# EAGLE design PIC PROTO-BOARD (EAGLE 9.2.2)

## Sheet 1 of 2
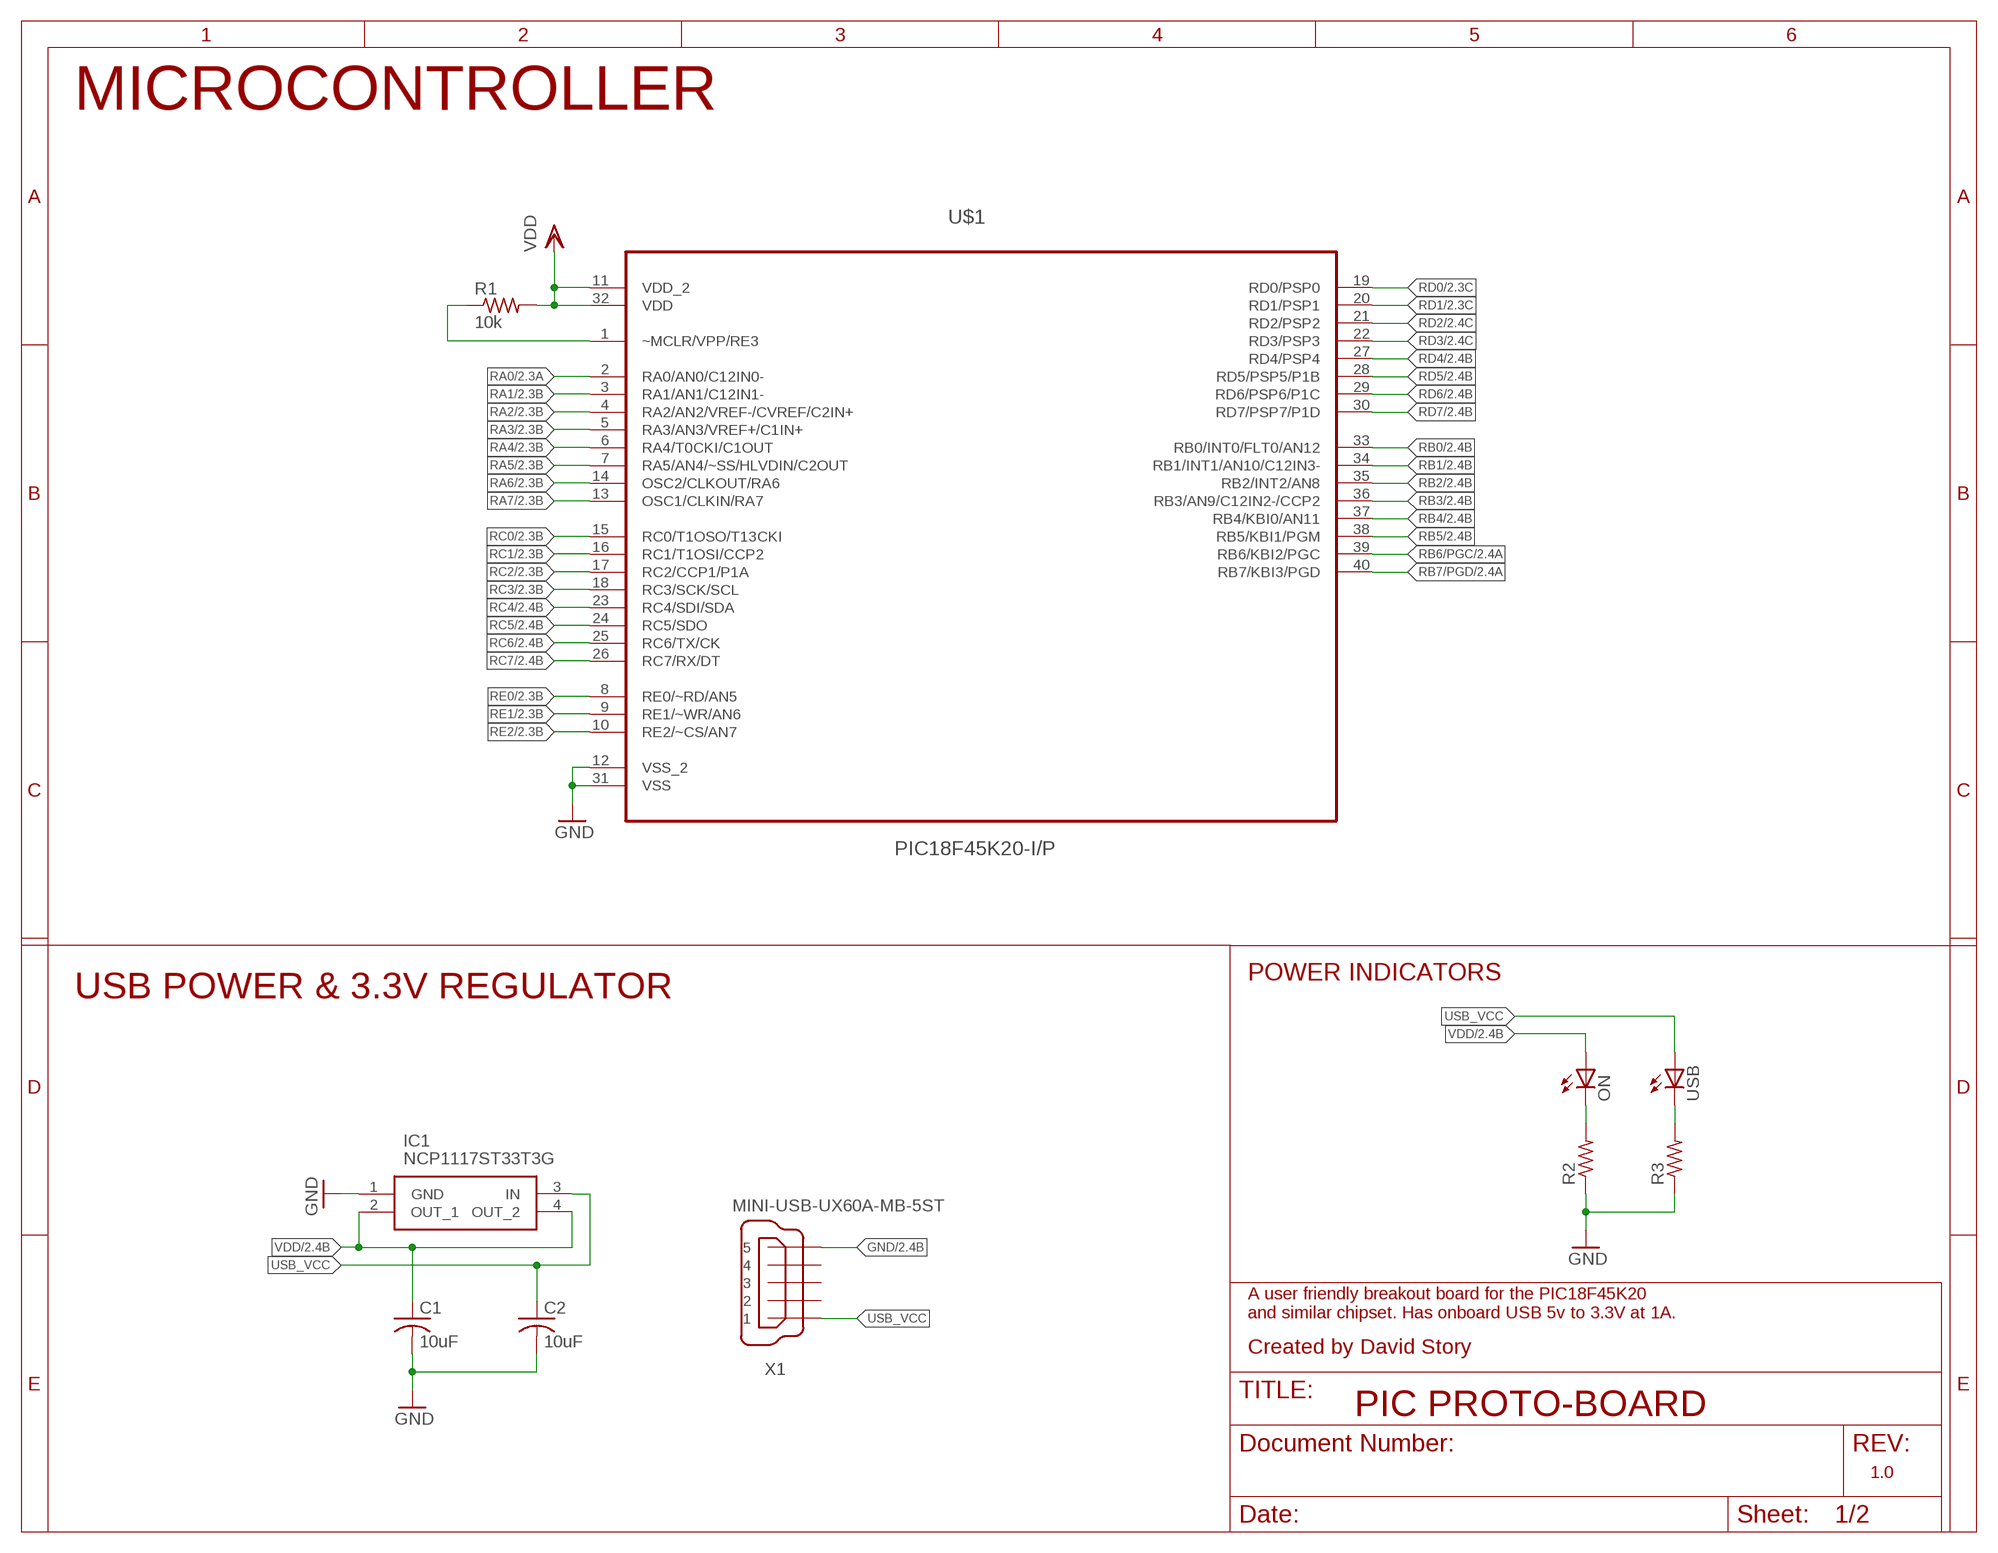
[diagram p0: schematic, sheet 1]

### Parts
C1  10uF  C-USC0805  [C0805]
C2  10uF  C-USC0805  [C0805]
IC1  NCP1117ST33T3G  [SOT230P700X180-4N]
ON  LEDCHIP-LED0603  [CHIP-LED0603]
R1  10k  R-US_R0805  [R0805]
R2  R-US_R0603  [R0603]
R3  R-US_R0603  [R0603]
U$1  PIC18F45K20-I/P  [DIP254P1524X635-40]
USB  LEDCHIP-LED0603  [CHIP-LED0603]
X1  MINI-USB-UX60A-MB-5ST  [UX60A-MB-5ST]

### Nets
GND: C1.2 C2.2 IC1.1(GND) R2.1 R3.1 U$1.12(VSS_2) U$1.31(VSS) X1.5 ; also sheet 2
MCLR: R1.1 U$1.1(~MCLR/VPP/RE3) ; also sheet 2
ON_CATHODE: ON.C R2.2
RA0: U$1.2(RA0/AN0/C12IN0-) ; also sheet 2
RA1: U$1.3(RA1/AN1/C12IN1-) ; also sheet 2
RA2: U$1.4(RA2/AN2/VREF-/CVREF/C2IN+) ; also sheet 2
RA3: U$1.5(RA3/AN3/VREF+/C1IN+) ; also sheet 2
RA4: U$1.6(RA4/T0CKI/C1OUT) ; also sheet 2
RA5: U$1.7(RA5/AN4/~SS/HLVDIN/C2OUT) ; also sheet 2
RA6: U$1.14(OSC2/CLKOUT/RA6) ; also sheet 2
RA7: U$1.13(OSC1/CLKIN/RA7) ; also sheet 2
RB0: U$1.33(RB0/INT0/FLT0/AN12) ; also sheet 2
RB1: U$1.34(RB1/INT1/AN10/C12IN3-) ; also sheet 2
RB2: U$1.35(RB2/INT2/AN8) ; also sheet 2
RB3: U$1.36(RB3/AN9/C12IN2-/CCP2) ; also sheet 2
RB4: U$1.37(RB4/KBI0/AN11) ; also sheet 2
RB5: U$1.38(RB5/KBI1/PGM) ; also sheet 2
RB6/PGC: U$1.39(RB6/KBI2/PGC) ; also sheet 2
RB7/PGD: U$1.40(RB7/KBI3/PGD) ; also sheet 2
RC0: U$1.15(RC0/T1OSO/T13CKI) ; also sheet 2
RC1: U$1.16(RC1/T1OSI/CCP2) ; also sheet 2
RC2: U$1.17(RC2/CCP1/P1A) ; also sheet 2
RC3: U$1.18(RC3/SCK/SCL) ; also sheet 2
RC4: U$1.23(RC4/SDI/SDA) ; also sheet 2
RC5: U$1.24(RC5/SDO) ; also sheet 2
RC6: U$1.25(RC6/TX/CK) ; also sheet 2
RC7: U$1.26(RC7/RX/DT) ; also sheet 2
RD0: U$1.19(RD0/PSP0) ; also sheet 2
RD1: U$1.20(RD1/PSP1) ; also sheet 2
RD2: U$1.21(RD2/PSP2) ; also sheet 2
RD3: U$1.22(RD3/PSP3) ; also sheet 2
RD4: U$1.27(RD4/PSP4) ; also sheet 2
RD5: U$1.28(RD5/PSP5/P1B) ; also sheet 2
RD6: U$1.29(RD6/PSP6/P1C) ; also sheet 2
RD7: U$1.30(RD7/PSP7/P1D) ; also sheet 2
RE0: U$1.8(RE0/~RD/AN5) ; also sheet 2
RE1: U$1.9(RE1/~WR/AN6) ; also sheet 2
RE2: U$1.10(RE2/~CS/AN7) ; also sheet 2
USB_CATHODE: R3.2 USB.C
USB_VCC: C2.1 IC1.3(IN) USB.A X1.1
VDD: C1.1 IC1.2(OUT_1) IC1.4(OUT_2) ON.A R1.2 U$1.11(VDD_2) U$1.32(VDD) ; also sheet 2
Unconnected: X1.2 X1.3 X1.4

### Notes on the sheet
- MICROCONTROLLER
- POWER INDICATORS
- USB POWER & 3.3V REGULATOR
- A user friendly breakout board for the PIC18F45K20
  and similar chipset. Has onboard USB 5v to 3.3V at 1A.
- Created by David Story
- 1.0

## Sheet 2 of 2
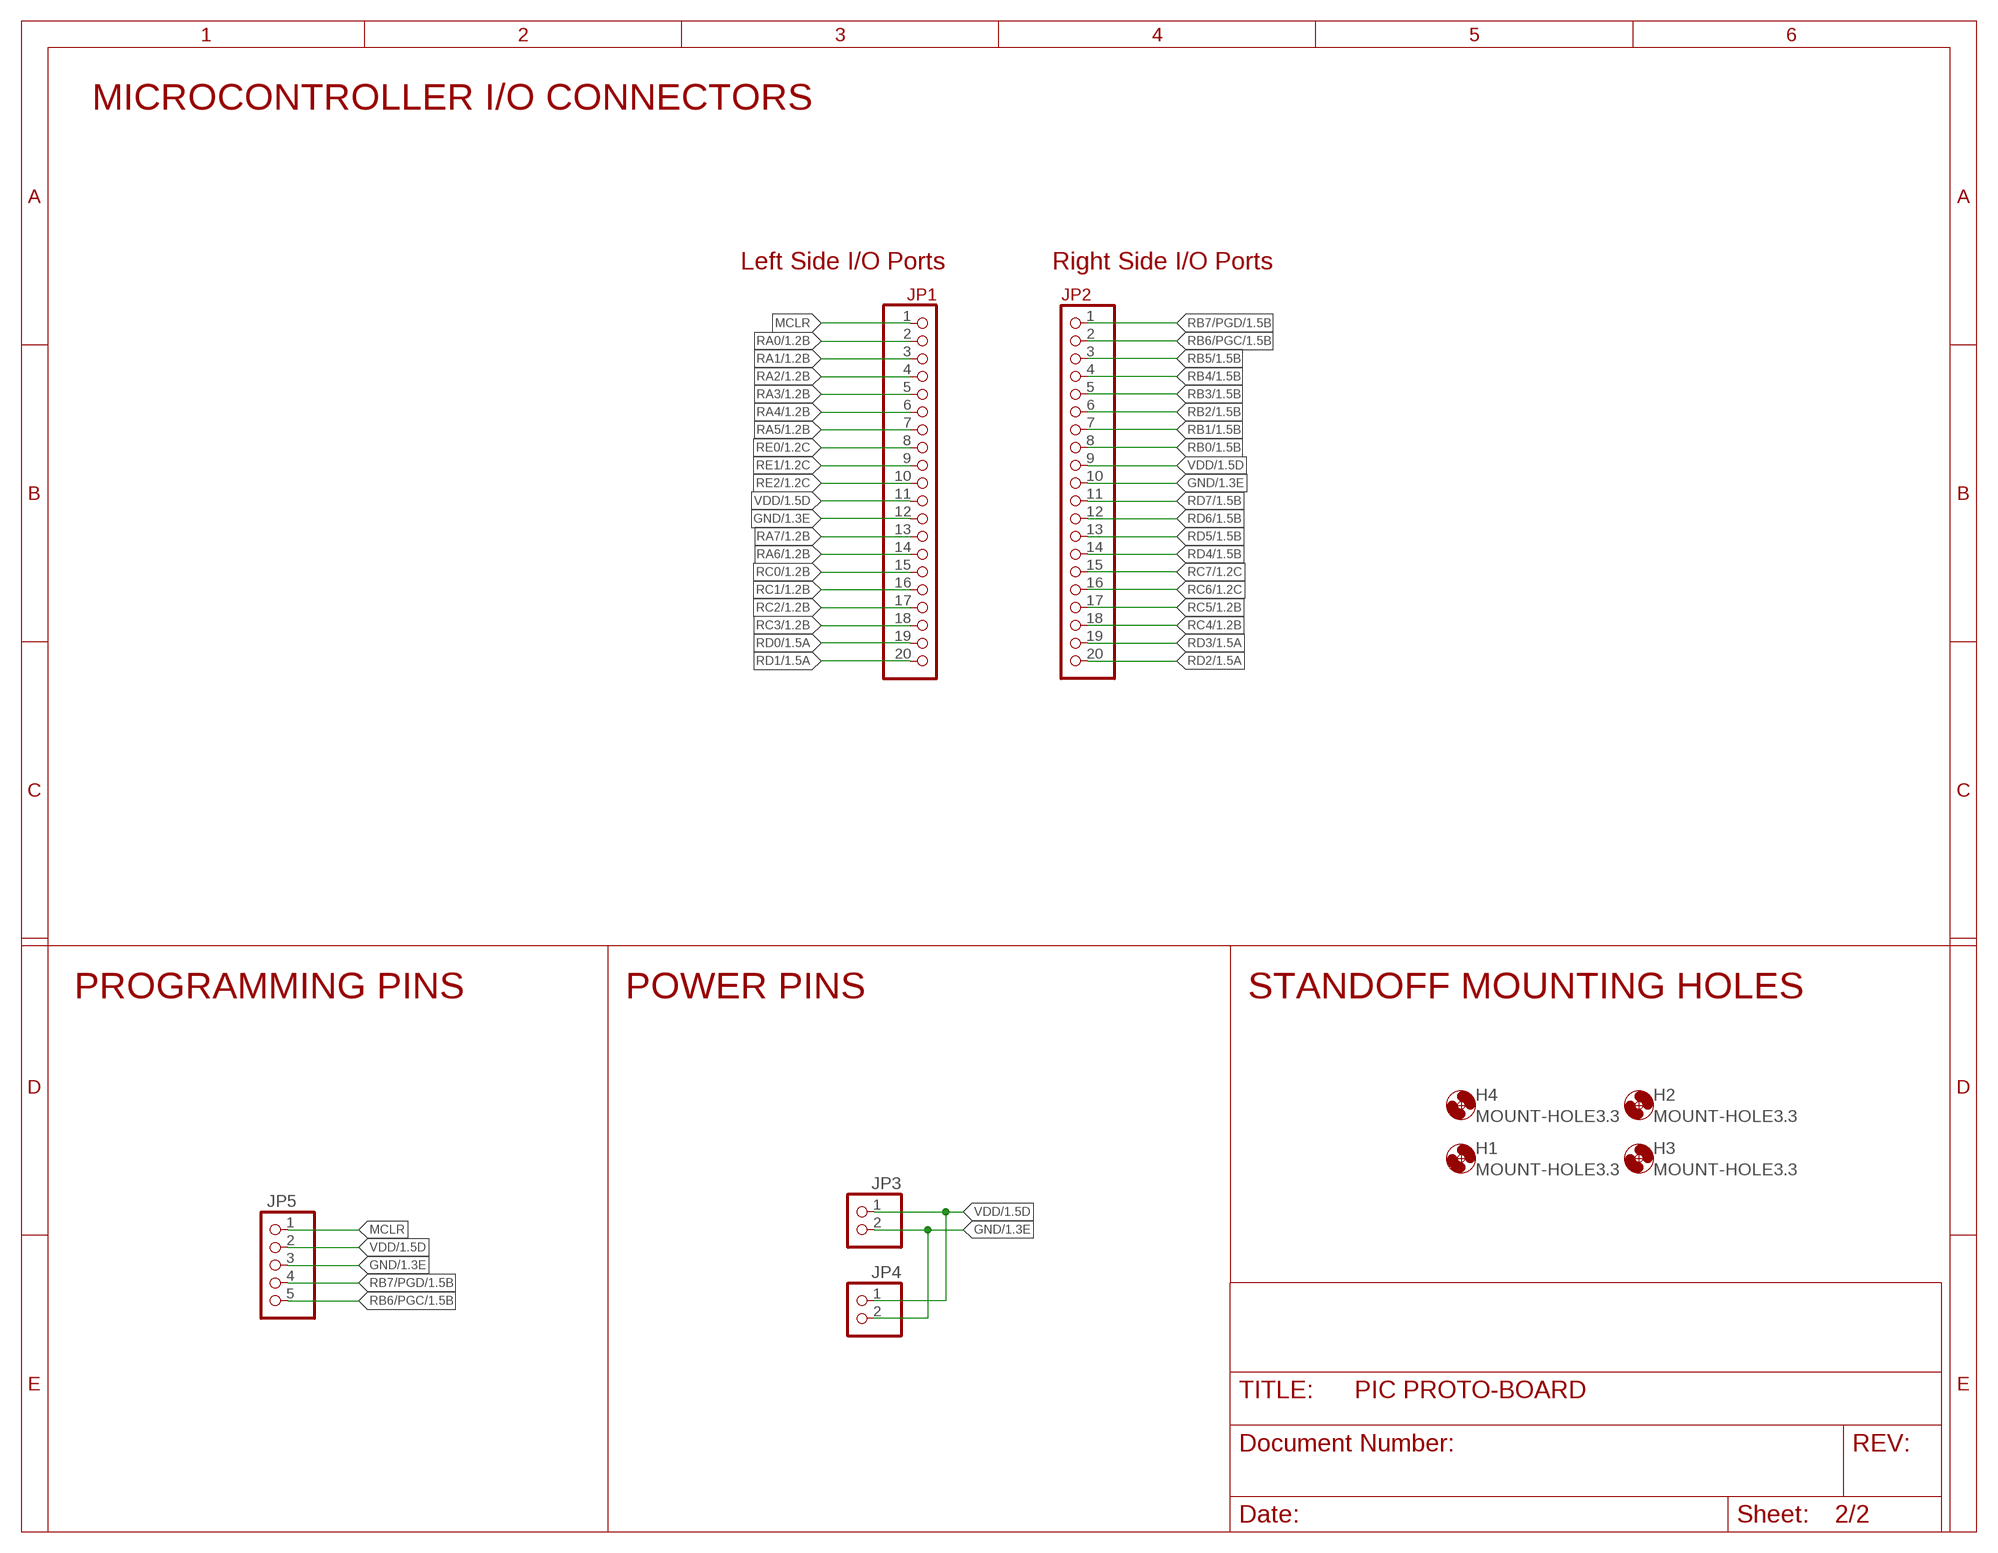
[diagram p1: schematic, sheet 2]

### Parts
H1  MOUNT-HOLE3.3  [3,3]
H2  MOUNT-HOLE3.3  [3,3]
H3  MOUNT-HOLE3.3  [3,3]
H4  MOUNT-HOLE3.3  [3,3]
JP1  PINHD-1X20  [1X20]
JP2  PINHD-1X20  [1X20]
JP3  PINHD-1X2  [1X02]
JP4  PINHD-1X2  [1X02]
JP5  PINHD-1X5  [1X05]

### Nets
GND: JP1.12 JP2.10 JP3.2 JP4.2 JP5.3 ; also sheet 1
MCLR: JP1.1 JP5.1 ; also sheet 1
RA0: JP1.2 ; also sheet 1
RA1: JP1.3 ; also sheet 1
RA2: JP1.4 ; also sheet 1
RA3: JP1.5 ; also sheet 1
RA4: JP1.6 ; also sheet 1
RA5: JP1.7 ; also sheet 1
RA6: JP1.14 ; also sheet 1
RA7: JP1.13 ; also sheet 1
RB0: JP2.8 ; also sheet 1
RB1: JP2.7 ; also sheet 1
RB2: JP2.6 ; also sheet 1
RB3: JP2.5 ; also sheet 1
RB4: JP2.4 ; also sheet 1
RB5: JP2.3 ; also sheet 1
RB6/PGC: JP2.2 JP5.5 ; also sheet 1
RB7/PGD: JP2.1 JP5.4 ; also sheet 1
RC0: JP1.15 ; also sheet 1
RC1: JP1.16 ; also sheet 1
RC2: JP1.17 ; also sheet 1
RC3: JP1.18 ; also sheet 1
RC4: JP2.18 ; also sheet 1
RC5: JP2.17 ; also sheet 1
RC6: JP2.16 ; also sheet 1
RC7: JP2.15 ; also sheet 1
RD0: JP1.19 ; also sheet 1
RD1: JP1.20 ; also sheet 1
RD2: JP2.20 ; also sheet 1
RD3: JP2.19 ; also sheet 1
RD4: JP2.14 ; also sheet 1
RD5: JP2.13 ; also sheet 1
RD6: JP2.12 ; also sheet 1
RD7: JP2.11 ; also sheet 1
RE0: JP1.8 ; also sheet 1
RE1: JP1.9 ; also sheet 1
RE2: JP1.10 ; also sheet 1
VDD: JP1.11 JP2.9 JP3.1 JP4.1 JP5.2 ; also sheet 1

### Notes on the sheet
- MICROCONTROLLER I/O CONNECTORS
- Left Side I/O Ports | Right Side I/O Ports
- PROGRAMMING PINS | POWER PINS | STANDOFF MOUNTING HOLES

## Library data of the parts
C1 C2 = rcl:C-US: CAPACITOR, American symbol; SPICEPREFIX: C
H1-H4 = holes:MOUNT-HOLE: MOUNTING HOLE with drill center marker
IC1 = SamacSys_Parts:NCP1117ST33T3G: ON SEMICONDUCTOR - NCP1117ST33T3G - IC, LINEAR VOLTAGE REGULATOR Source: Datasheet <https://componentsearchengine.com/Datasheets/1/NCP1117ST33T3G.pdf>; DESCRIPTION: ON SEMICONDUCTOR - NCP1117ST33T3G - IC, LINEAR VOLTAGE REGULATOR; HEIGHT: 1.8mm; MANUFACTURER_NAME: ON Semiconductor; MANUFACTURER_PART_NUMBER: NCP1117ST33T3G; MOUSER_PART_NUMBER: 863-NCP1117ST33T3G
JP1 JP2 = pinhead:PINHD-1X20: PIN HEADER
JP3 JP4 = pinhead:PINHD-1X2: PIN HEADER
JP5 = pinhead:PINHD-1X5: PIN HEADER
ON USB = led:LED: LED OSRAM: - CHIPLED LG R971, LG N971, LY N971, LG Q971, LY Q971, LO R971, LY R971 LH N974, LH R974 LS Q976, LO Q976, LY Q976 LO Q996 - Hyper CHIPLED LW Q18S LB Q993, LB Q99A, LB R99A - SideLED LS A670, LO A670, LY A670, LG A670, LP A670 LB A673, LV A673, LT A673, LW A673 LH A674 LY A675 LS A676, LA A676, LO A676, LY A676, LW A676 LS A679, LY A679, LG A679 - Hyper Micro SIDELED® LS Y876, LA Y876, LO Y876, LY Y876 LT Y87S - SmartLED LW L88C, LW L88S LB L89C, LB L89S, LG L890 LS L89K, LO L89K, LY L89K LS L896, LA L896, LO L896, LY L896 - TOPLED LS T670, LO T670, LY T670, LG T670, LP T670 LSG T670, LSP T670, LSY T670, LOP T670, LYG T670 LG T671, LOG T671, LSG T671 LB T673, LV T673, LT T673, LW T673 LH T674 LS T676, LA T676, LO T676, LY T676, LB T676, LH T676, LSB T676, LW T676 LB T67C, LV T67C, LT T67C, LS T67K, LO T67K, LY T67K, LW E67C LS E67B, LA E67B, LO E67B, LY E67B, LB E67C, LV E67C, LT E67C LW T67C LS T679, LY T679, LG T679 LS T770, LO T770, LY T770, LG T770, LP T770 LB T773, LV T773, LT T773, LW T773 LH T774 LS E675, LA E675, LY E675, LS T675 LS T776, LA T776, LO T776, LY T776, LB T776 LHGB T686 LT T68C, LB T68C - Hyper Mini TOPLED® LB M676 - Mini TOPLED Santana® LG M470 LS M47K, LO M47K, LY M47K Source: http://www.osram.convergy.de LUXEON: - LUMILED® LXK2-PW12-R00, LXK2-PW12-S00, LXK2-PW14-U00, LXK2-PW14-V00 LXK2-PM12-R00, LXK2-PM12-S00, LXK2-PM14-U00 LXK2-PE12-Q00, LXK2-PE12-R00, LXK2-PE12-S00, LXK2-PE14-T00, LXK2-PE14-U00 LXK2-PB12-K00, LXK2-PB12-L00, LXK2-PB12-M00, LXK2-PB14-N00, LXK2-PB14-P00, LXK2-PB14-Q00 LXK2-PR12-L00, LXK2-PR12-M00, LXK2-PR14-Q00, LXK2-PR14-R00 LXK2-PD12-Q00, LXK2-PD12-R00, LXK2-PD12-S00 LXK2-PH12-R00, LXK2-PH12-S00 LXK2-PL12-P00, LXK2-PL12-Q00, LXK2-PL12-R00 Source: www.luxeon.com KINGBRIGHT: KA-3528ASYC Source: www.kingbright.com
R1-R3 = rcl:R-US_: RESISTOR, American symbol; SPICEPREFIX: R
U$1 = Microchip_By_element14_Batch_1:PIC18F45K20-I/P: Flash Microcontrollers; MPN: PIC18F45K20-I/P; OC_FARNELL: 1439588; OC_NEWARK: 88K6041; PACKAGE: DIP-40; SUPPLIER: Microchip
X1 = con-hirose:MINI-USB-: MINI USB Connector Source: http://www.hirose.co.jp/cataloge_hp/e24000019.pdf; OC_FARNELL: unknown; OC_NEWARK: unknown

## Board
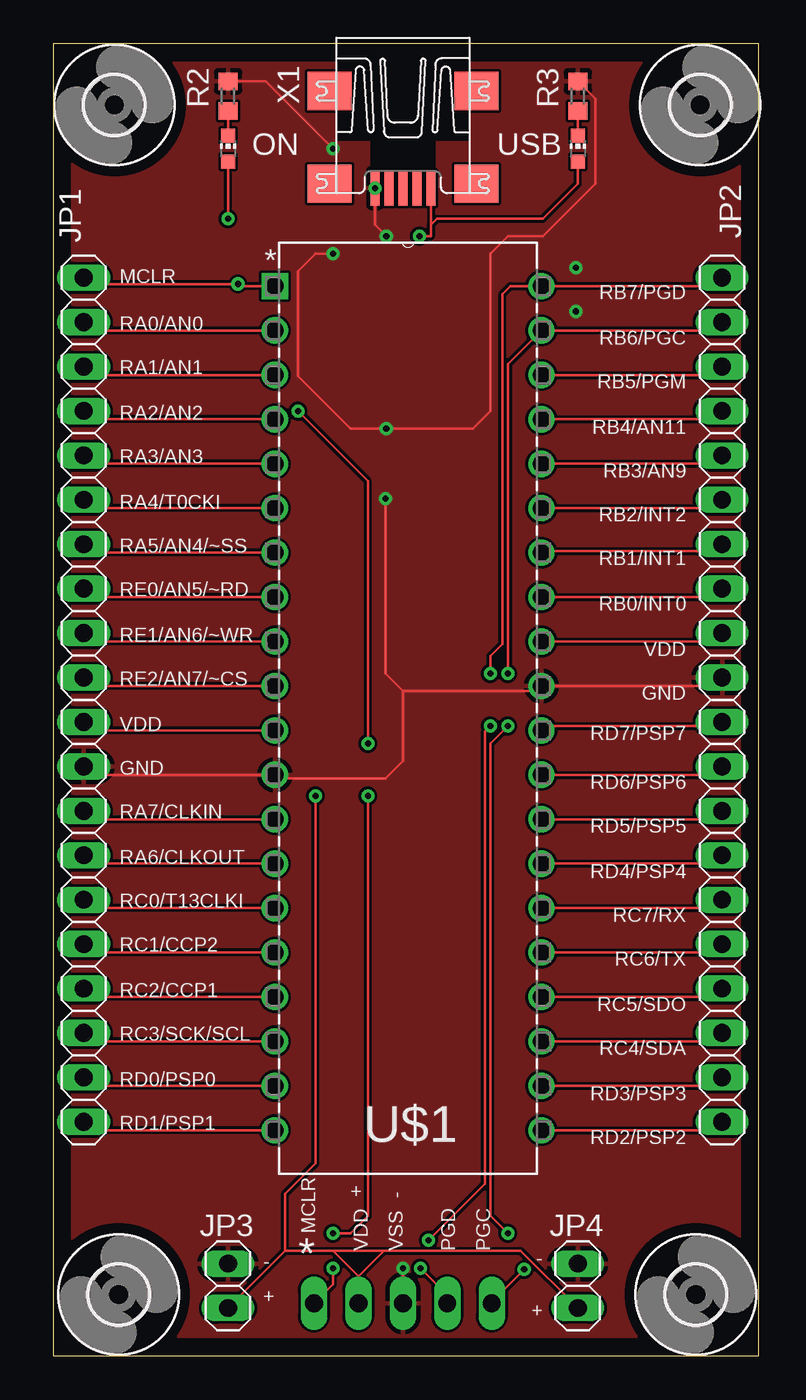
[diagram p2: board, top side]
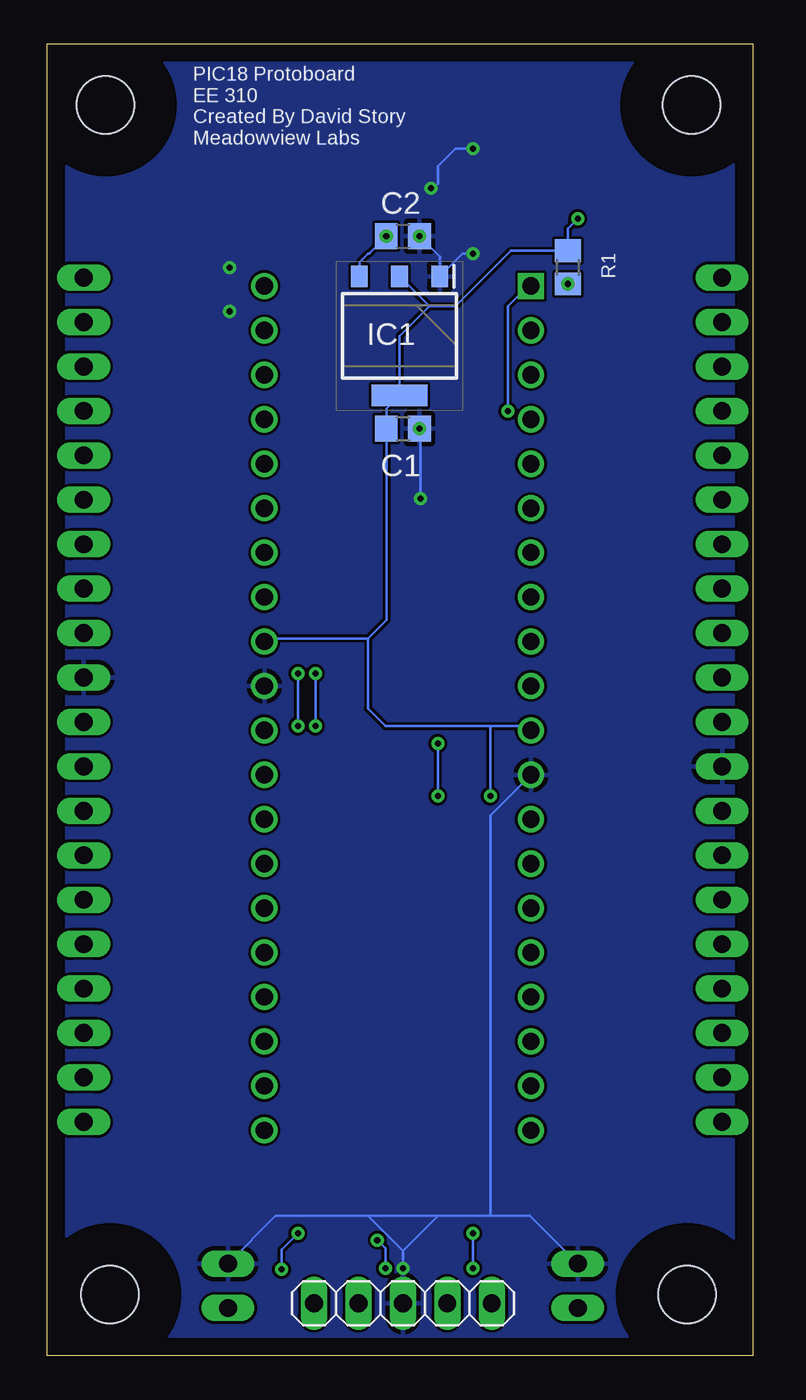
[diagram p3: board, bottom side, seen from below]

Size 40.35 x 75 mm. Coordinates in mm from the lower left corner, seen from the top.
Outline: 0,0 40.35,0 40.35,75 0,75 0,0
Copper layers (1*16): Top 0.035mm / dielectric 1.5mm / Bottom 0.035mm
Design rules "default": minimum track width 6mil, minimum drill 0.35mm, track to track 6mil, track to pad 6mil, pad to pad 6mil, via to via 6mil, smd to smd 6mil, copper to edge 40mil, drill to drill 6mil, minimum pad ring 10mil, minimum via ring 8mil, stop-mask expansion 4mil, vias tented up to drill 0mil, thermal gap 10mil

### Footprints (pad centres in the part's own frame; a part is rotated, then mirrored left to right if it is on the bottom)
C0805 = smd 1.3 x 1.5: 1 -0.95,0; 2 0.95,0
3,3 = hole 3.3: 0,0
SOT230P700X180-4N = smd 1.25 x 0.95: 1 -3.4,2.3; 2 -3.4,0; 3 -3.4,-2.3 | smd 1.25 x 3.2: 4 3.4,0
1X20 = drill 1.016 long: 1 -24.13,0; 2 -21.59,0; 3 -19.05,0; 4 -16.51,0; 5 -13.97,0; 6 -11.43,0; 7 -8.89,0; 8 -6.35,0; 9 -3.81,0; 10 -1.27,0; 11 1.27,0; 12 3.81,0; 13 6.35,0; 14 8.89,0; 15 11.43,0; 16 13.97,0; 17 16.51,0; 18 19.05,0; 19 21.59,0; 20 24.13,0
1X02 = drill 1.016 long: 1 -1.27,0; 2 1.27,0
1X05 = drill 1.016 long: 1 -5.08,0; 2 -2.54,0; 3 0,0; 4 2.54,0; 5 5.08,0
CHIP-LED0603 = smd 0.8 x 0.8: A 0,-0.75; C 0,0.75
R0805 = smd 1.3 x 1.5: 1 -0.95,0; 2 0.95,0
R0603 = smd 1 x 1.1: 1 -0.85,0; 2 0.85,0
DIP254P1524X635-40 = drill 0.991 square: 1 -15.24,48.26 | drill 0.991: 2 -15.24,45.72; 3 -15.24,43.18; 4 -15.24,40.64; 5 -15.24,38.1; 6 -15.24,35.56; 7 -15.24,33.02; 8 -15.24,30.48; 9 -15.24,27.94; 10 -15.24,25.4; 11 -15.24,22.86; 12 -15.24,20.32; 13 -15.24,17.78; 14 -15.24,15.24; 15 -15.24,12.7; 16 -15.24,10.16; 17 -15.24,7.62; 18 -15.24,5.08; 19 -15.24,2.54; 20 -15.24,0; 21 0,0; 22 0,2.54; 23 0,5.08; 24 0,7.62; 25 0,10.16; 26 0,12.7; 27 0,15.24; 28 0,17.78; 29 0,20.32; 30 0,22.86; 31 0,25.4; 32 0,27.94; 33 0,30.48; 34 0,33.02; 35 0,35.56; 36 0,38.1; 37 0,40.64; 38 0,43.18; 39 0,45.72; 40 0,48.26
UX60A-MB-5ST = smd 2 x 0.5: 1 2.25,1.6; 2 2.25,0.8; 3 2.25,0; 4 2.25,-0.8; 5 2.25,-1.6 | smd 2.2 x 2.5: M1 -3.3,-4.2; M2 -3.3,4.2; M3 2,4.2; M4 2,-4.2

### Placement (x,y rotation side)
C1  20,53 0 bottom
C2  20,64 0 bottom
H1  36.75,3.5 0 top
H2  3.75,3.5 0 top
H3  37,71.5 0 top
H4  3.5,71.5 0 top
IC1  20.19,58.3 270 bottom
JP1  1.75,37.5 270 top
JP2  38.25,37.5 270 top
JP3  10,4 90 top
JP4  30,4 90 top
JP5  20,3 180 bottom
ON  10,69 0 top
R1  10.57,62.22 90 bottom
R2  10,72 270 top
R3  30,72 270 top
U$1  27.92,12.89 0 top
USB  30,69 0 top
X1  20,69 270 top

### Tracks (layer width: path | path; a pad name or v marks a point on that pad's centre or on a via)
GND  (via drill 0.35)
  Top 0.152: JP1.12 2.23,33.21 U$1.12 12.89,33 19,33 20,34 20,38 | v20,5 JP5.3 | U$1.31 28,38.29 | 28,38.29 37.77,38.29 JP2.10 | X1.5 18.4,64.65 C2.2 | R2.1 12.15,72.85 v16,69 | v16,63 15,63 14,62 14,56 17,53 C1.2 24,53 25,54 25,63 26,64 28,64 31,67 31,71.85 R3.1 | 20,38 19,39 v19,49 | 20,38 27.71,38 28,38.29
  Bottom 0.152: v20,5 20,6 | 20,6 22,8 | JP4.2 27.27,8 22,8 | 22,8 18,8 | 18,8 15,8 | 15,8 12.73,8 JP3.2 | 20,6 18,8 | C2.2 17.89,62.84 IC1.1 16.59,63 v16,63 | v16,69 17,69 18,68 18,67 18.25,66.75 X1.5 | C1.2 19,52.95 v19,49 | 15,8 15,30.89 U$1.12
  other vias: 19.05,64 18.4,66.75 19.05,53 29.9,62.2 29.9,59.7
  pour Top: 0,75 40,75 40,0 0,0
  pour Bottom: 0,75 40,75 40,0 0,0
MCLR  (via drill 0.35)
  Top 0.152: U$1.1 10.69,61.15 R1.1 2.11,61.27 JP1.1 | JP5.1 16,4.08 v16,5 | v16,7 17,7 18,8 v18,32 | v18,35 18,50 v14,54
  Bottom 0.152: v16,5 v16,7 | v18,32 v18,35 | v14,54 14,60 12.85,61.15 U$1.1
  other vias: 10.57,61.27
ON_CATHODE
  Top 0.152: ON.C R2.2
RA0
  Top 0.152: U$1.2 2.23,58.61 JP1.2
RA1
  Top 0.152: U$1.3 2.23,56.07 JP1.3
RA2
  Top 0.152: U$1.4 2.23,53.53 JP1.4
RA3
  Top 0.152: U$1.5 2.23,50.99 JP1.5
RA4
  Top 0.152: U$1.6 2.23,48.45 JP1.6
RA5
  Top 0.152: U$1.7 2.23,45.91 JP1.7
RA6
  Top 0.152: U$1.14 2.23,28.13 JP1.14
RA7
  Top 0.152: U$1.13 2.23,30.67 JP1.13
RB0
  Top 0.152: U$1.33 37.77,43.37 JP2.8
RB1
  Top 0.152: U$1.34 28.01,46 38,46 38.25,46.25 JP2.7
RB2
  Top 0.152: U$1.35 37.77,48.45 JP2.6
RB3
  Top 0.152: U$1.36 37.77,50.99 JP2.5
RB4
  Top 0.152: U$1.37 37.77,53.53 JP2.4
RB5
  Top 0.152: U$1.38 37.77,56.07 JP2.3
RB6/PGC  (via drill 0.35)
  Top 0.152: JP5.5 25.08,3.08 v26.94,4.94 | v26,7 25,8 25,35 v26,36 | 26,42 v26,39 26,56.69 U$1.39 37.77,58.61 JP2.2
  Bottom 0.152: v26.94,4.94 26.94,6.06 v26,7 | v26,36 v26,39
RB7/PGD  (via drill 0.35)
  Top 0.152: JP5.4 22.54,3.46 v21,5 | v21.46,6.61 24.7,9.84 24.7,35.7 v25,36 | v25,39 25,40 25.7,40.7 25.7,60.7 26.15,61.15 U$1.40 37.77,61.15 JP2.1
  Bottom 0.152: v21,5 21,6.14 v21.46,6.61 | v25,36 v25,39
RC0
  Top 0.152: U$1.15 2.23,25.59 JP1.15
RC1
  Top 0.152: U$1.16 2.23,23.05 JP1.16
RC2
  Top 0.152: U$1.17 2.23,20.51 JP1.17
RC3
  Top 0.152: U$1.18 2.23,17.97 JP1.18
RC4
  Top 0.152: U$1.23 37.77,17.97 JP2.18
RC5
  Top 0.152: U$1.24 37.77,20.51 JP2.17
RC6
  Top 0.152: U$1.25 37.77,23.05 JP2.16
RC7
  Top 0.152: U$1.26 37.77,25.59 JP2.15
RD0
  Top 0.152: U$1.19 2.23,15.43 JP1.19
RD1
  Top 0.152: U$1.20 2.23,12.89 JP1.20
RD2
  Top 0.152: U$1.21 37.77,12.89 JP2.20
RD3
  Top 0.152: U$1.22 37.77,15.43 JP2.19
RD4
  Top 0.152: U$1.27 37.77,28.13 JP2.14
RD5
  Top 0.152: U$1.28 37.77,30.67 JP2.13
RD6
  Top 0.152: U$1.29 37.77,33.21 JP2.12
RD7
  Top 0.152: U$1.30 28.17,36 38.02,36 JP2.11
RE0
  Top 0.152: U$1.8 2.23,43.37 JP1.8
RE1
  Top 0.152: U$1.9 2.23,40.83 JP1.9
RE2
  Top 0.152: U$1.10 2.23,38.29 JP1.10
USB_CATHODE
  Top 0.152: USB.C R3.2
USB_VCC  (via drill 0.35)
  Top 0.152: X1.1 21.6,64.65 | 21.6,64.65 21.6,64 C2.1 | 21.6,64.65 21.95,65 28,65 30,67 USB.A
  Bottom 0.152: C2.1 21.95,63 22,63 22.49,62.51 IC1.3
  other vias: 20.95,64
VDD  (via drill 0.35)
  Top 0.152: U$1.11 2.23,35.75 JP1.11 | JP3.1 13.27,6 | JP4.1 26.73,6 18.92,6 | 13.27,6 16,6 | 16,6 18.92,6 | JP5.2 17.46,4.54 | 17.46,4.54 16,6 | 17.46,4.54 18.92,6 | U$1.32 37.77,40.83 JP2.9 | v10,65 ON.A | 13.27,6 13.27,9.27 15,11 v15,32
  Bottom 0.152: IC1.2 18.49,60 | 18.49,60 17,60 13.83,63.17 R1.2 10.57,64.43 v10,65 | 18.49,60 20.19,58.3 IC1.4 20.95,54.14 C1.1 20.95,42.05 22,41 | U$1.32 27.75,41 22,41 | 15,36 21,36 22,37 22,41 | 15,36 12.93,36 U$1.11 | v15,32 15,36

### Text on the board
tNames: MCLR | RB7/PGD | RA0/AN0 | RB6/PGC | RA1/AN1 | RB5/PGM | RA2/AN2 | RB4/AN11 | RA3/AN3 | RB3/AN9 | RA4/T0CKI | RB2/INT2 | RA5/AN4/~SS | RB1/INT1 | RE0/AN5/~RD | RB0/INT0 | RE1/AN6/~WR | VDD | RE2/AN7/~CS | GND | VDD | RD7/PSP7 | GND | RD6/PSP6 | RA7/CLKIN | RD5/PSP5 | RA6/CLKOUT | RD4/PSP4 | RC0/T13CLKI | RC7/RX | RC1/CCP2 | RC6/TX | RC2/CCP1 | RC5/SDO | RC3/SCK/SCL | RC4/SDA | RD0/PSP0 | RD3/PSP3 | RD1/PSP1 | RD2/PSP2 | + | - | MCLR | VDD | VSS | PGD | PGC | - | - | * | + | +
bNames: PIC18 Protoboard / EE 310 / Created By David Story / Meadowview Labs